# Altium schematic sheet Macropad_txt.SchDoc
size Letter; SheetNumber: 1; SheetTotal: 1
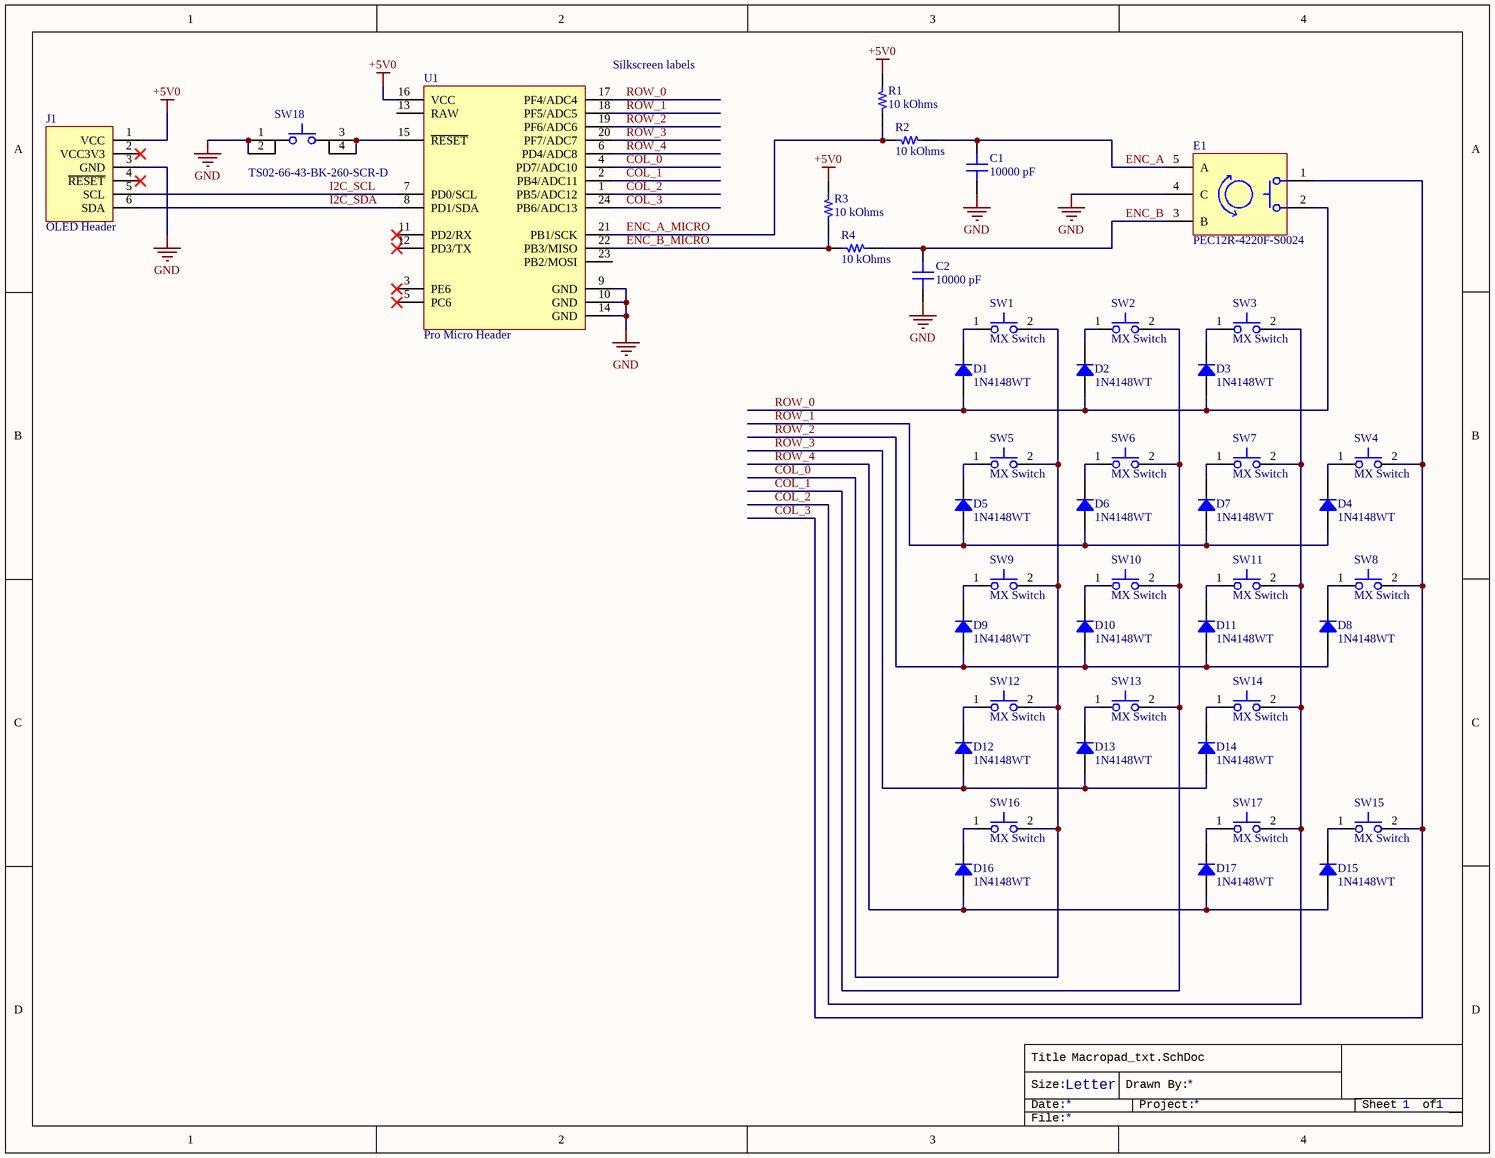
[diagram p0: Macropad_txt.SchDoc]

## Parts
C1  10000 pF  [CAP 0603_1608]
C2  10000 pF  [CAP 0603_1608]
D1  1N4148WT  [SOD523F]
D2  1N4148WT  [SOD523F]
D3  1N4148WT  [SOD523F]
D4  1N4148WT  [SOD523F]
D5  1N4148WT  [SOD523F]
D6  1N4148WT  [SOD523F]
D7  1N4148WT  [SOD523F]
D8  1N4148WT  [SOD523F]
D9  1N4148WT  [SOD523F]
D10  1N4148WT  [SOD523F]
D11  1N4148WT  [SOD523F]
D12  1N4148WT  [SOD523F]
D13  1N4148WT  [SOD523F]
D14  1N4148WT  [SOD523F]
D15  1N4148WT  [SOD523F]
D16  1N4148WT  [SOD523F]
D17  1N4148WT  [SOD523F]
E1  PEC12R-4220F-S0024
J1  OLED Header
R1  10 kOhms  [RES 0603_1608]
R2  10 kOhms  [RES 0603_1608]
R3  10 kOhms  [RES 0603_1608]
R4  10 kOhms  [RES 0603_1608]
SW1  MX Switch  [MXSwitch]
SW2  MX Switch  [MXSwitch]
SW3  MX Switch  [MXSwitch]
SW4  MX Switch  [MXSwitch]
SW5  MX Switch  [MXSwitch]
SW6  MX Switch  [MXSwitch]
SW7  MX Switch  [MXSwitch]
SW8  MX Switch  [MXSwitch]
SW9  MX Switch  [MXSwitch]
SW10  MX Switch  [MXSwitch]
SW11  MX Switch  [MXSwitch]
SW12  MX Switch  [MXSwitch]
SW13  MX Switch  [MXSwitch]
SW14  MX Switch  [MXSwitch]
SW15  MX Switch  [MXSwitch]
SW16  MX Switch  [MXSwitch]
SW17  MX Switch  [MXSwitch]
SW18  TS02-66-43-BK-260-SCR-D  [TS02-66-43-BK-260-SCR-D]
U1  Pro Micro Header

## Nets
+5V0: J1.1(VCC) R1.1 R3.1 U1.16(VCC)
GND: C1.1 C2.1 E1.4(C) J1.3(GND) SW18.1 SW18.2 U1.9(GND) U1.10(GND) U1.14(GND)
COL_0: SW1.2 SW5.2 SW9.2 SW12.2 SW16.2 U1.4(PD7/ADC10)
COL_1: SW2.2 SW6.2 SW10.2 SW13.2 U1.2(PB4/ADC11)
COL_2: SW3.2 SW7.2 SW11.2 SW14.2 SW17.2 U1.1(PB5/ADC12)
COL_3: E1.1 SW4.2 SW8.2 SW15.2 U1.24(PB6/ADC13)
ENC_A: C1.2 E1.5(A) R2.1
ENC_A_MICRO: R1.2 R2.2 U1.21(PB1/SCK)
ENC_B: C2.2 E1.3(B) R4.1
ENC_B_MICRO: R3.2 R4.2 U1.22(PB3/MISO)
I2C_SCL: J1.5(SCL) U1.7(PD0/SCL)
I2C_SDA: J1.6(SDA) U1.8(PD1/SDA)
ROW_0: D1.1 D2.1 D3.1 E1.2 U1.17(PF4/ADC4)
ROW_1: D4.1 D5.1 D6.1 D7.1 U1.18(PF5/ADC5)
ROW_2: D8.1 D9.1 D10.1 D11.1 U1.19(PF6/ADC6)
ROW_3: D12.1 D13.1 D14.1 U1.20(PF7/ADC7)
ROW_4: D15.1 D16.1 D17.1 U1.6(PD4/ADC8)
NetD1_2: D1.2 SW1.1
NetD2_2: D2.2 SW2.1
NetD3_2: D3.2 SW3.1
NetD4_2: D4.2 SW4.1
NetD5_2: D5.2 SW5.1
NetD6_2: D6.2 SW6.1
NetD7_2: D7.2 SW7.1
NetD8_2: D8.2 SW8.1
NetD9_2: D9.2 SW9.1
NetD10_2: D10.2 SW10.1
NetD11_2: D11.2 SW11.1
NetD12_2: D12.2 SW12.1
NetD13_2: D13.2 SW13.1
NetD14_2: D14.2 SW14.1
NetD15_2: D15.2 SW15.1
NetD16_2: D16.2 SW16.1
NetD17_2: D17.2 SW17.1
NetSW18_3: SW18.3 SW18.4 U1.15(~{RESET})

Not connected (* = marked no-connect by the designer): J1 2(VCC3V3)* 4(~{RESET})*; U1 3(PE6)* 5(PC6)* 11(PD2/RX)* 12(PD3/TX)* 13(RAW) 23(PB2/MOSI)

## Notes on the sheet
- (near U1) Silkscreen labels
- Title
- Size:
- Date:
- Letter
- Drawn By:
- Project:
- Sheet
- of
- File:

## Library data of the parts
C1 C2 = C0603C103KARACAUTO: CAP CER 0.01UF 250V X7R 0603; manufacturer: KEMET; Tolerance: ±10%; Part Number: C0603C103KARACAUTO; Value: 10000 pF; Applications: Automotive, Bypass, Decoupling; Capacitance: 10000 pF; componentlink1description: Datasheet; componentlink1url: https://api.kemet.com/component-edge/download/datasheet/C0603C103KARACAUTO.pdf; componentlink2description: DigiKey Link; componentlink2url: https://www.digikey.com/en/products/detail/kemet/C0603C103KARACAUTO/9084014; Device Package: 0603 (1608 Metric); lastupdated: 2022-05-23 12:54:35; Lifecycle Status: Active; Minimum Order: 1; Mounting Type: Surface Mount, MLCC; Operating Temperature: -55°C ~ 125°C; Package / Case: 0603 (1608 Metric); packaging: TapeAndReel; partid: 15195; Part Status: Active; price: 0.26; Ratings: AEC-Q200; series: SMD Auto X7R; Size / Dimension: 0.063" L x 0.031" W (1.60mm x 0.80mm); Supplier 1: DigiKey; Supplier Part Number 1: 399-17960-1-ND; Temperature Coefficient: X7R; Thickness (Max): 0.034" (0.87mm); Voltage - Rated: 250V
D1-D17 = 1N4148WT: DIODE GEN PURP 75V 200MA SOD523F; Manufacturer: ON Semiconductor; Current - Reverse Leakage @ Vr: 5µA @ 75V; Diode Type: Standard; Reverse Recovery Time (trr): 4ns; Speed: Small Signal =< 200mA (Io), Any Speed; Voltage - Forward (Vf) (Max) @ If: 1V @ 10mA; Part Number: 1N4148WT; ComponentLink1Description: Datasheet; ComponentLink1URL: https://www.onsemi.com/pub/Collateral/1N914BWT-D.pdf; ComponentLink2Description: DigiKey Link; ComponentLink2URL: http://digikey.com/product-detail/en/on-semiconductor/1N4148WT/1N4148WTCT-ND/2094398; Current - Average Rectified (Io): 200mA; LastUpdated: 2022-05-20 15:24:12; Lifecycle Status: Active; Minimum Order: 1; Mounting Type: Surface Mount; Operating Temperature - Junction: -55°C ~ 150°C; Package / Case: SC-79, SOD-523F; Packaging: TapeAndReel; PartId: 1180; Part Status: Active; Price: 0.03; Series: -; Supplier 1: DigiKey; Supplier Part Number 1: 1N4148WTCT-ND; Supplier Device Package: SOD-523F; Voltage - DC Reverse (Vr) (Max): 75V
R1-R4 = MCT0603MD1002BP100: RES SMD 10K OHM 0.1% 1/8W 0603; Manufacturer: Vishay Beyschlag; Power (Watts): 0.125W, 1/8W; Temperature Coefficient: ±25ppm/°C; Part Number: MCT0603MD1002BP100; Value: 10 kOhms; ComponentLink1Description: Datasheet; ComponentLink1URL: http://www.vishay.com/docs/28785/mcat_pre.pdf; ComponentLink2Description: DigiKey Link; ComponentLink2URL: http://digikey.com/product-detail/en/vishay-beyschlag/MCT0603MD1002BP100/MCT0603-10K-MBCT-ND/2092141; Composition: Thin Film; Device Package: 0603 (1608 Metric); Features: Anti-Sulfur, Automotive AEC-Q200; Height - Seated (Max): 0.022" (0.55mm); LastUpdated: 2022-05-23 13:14:20; Lifecycle Status: Active; Minimum Order: 1; Number of Terminations: 2; Operating Temperature: -55°C ~ 155°C; Package / Case: 0603 (1608 Metric); Packaging: TapeAndReel; PartId: 14322; Part Status: Active; Price: 0.23; Ratings: AEC-Q200; Resistance: 10 kOhms; Series: MCT AT - Precision; Size / Dimension: 0.061" L x 0.033" W (1.55mm x 0.85mm); Supplier 1: DigiKey; Supplier Part Number 1: MCT0603-10K-MBCT-ND; Supplier Device Package: 0603; Tolerance: ±0.1%
U1 = DEV-12640: Pro Micro
E1 = PEC12R-4220F-S0024: ComponentLink1Description: Datasheet; ComponentLink1URL: https://www.bourns.com/docs/Product-Datasheets/PEC12R.pdf